# Altium schematic sheet Power_Input.SchDoc: Power input
size A4; SheetNumber: 2; SheetTotal: 4
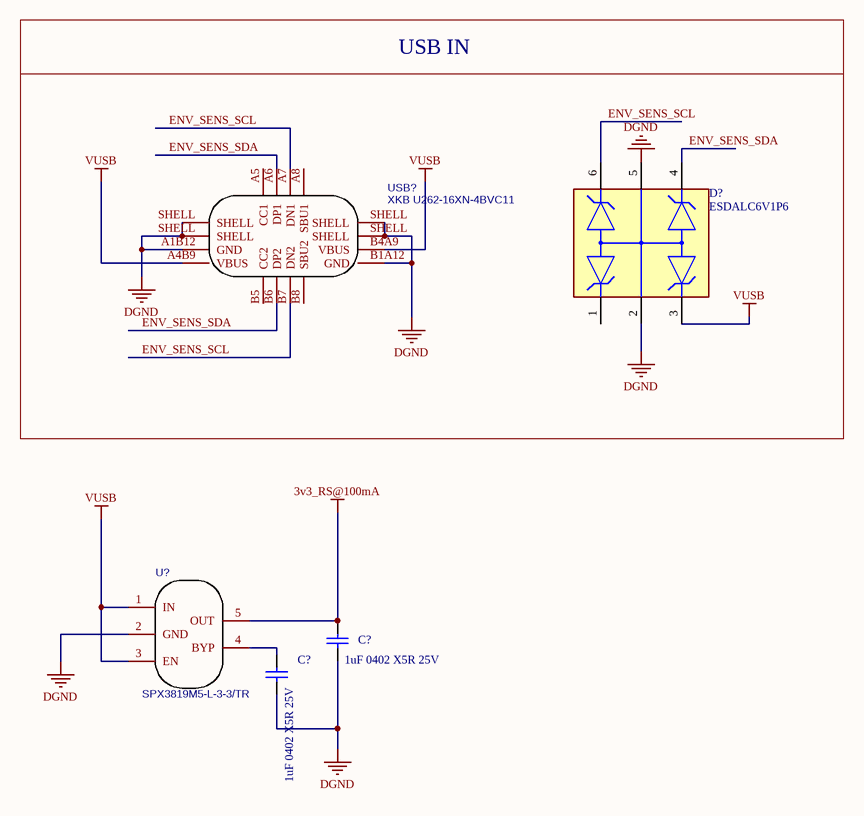
[diagram p0: Power_Input.SchDoc]

## Parts
(Parts that share a designator on the sheet are numbered #1, #2 ... from top to bottom, then left to right.)
C?#1  1uF 0402 X5R 25V  [CAPC1005X55X25NL5T10]
C?#2  1uF 0402 X5R 25V  [CAPC1005X55X25NL5T10]
D?  ESDALC6V1P6  [FP-SOT-666IP-MFG]
U?  SPX3819M5-L-3-3/TR  [SOT-23-5_L3.0-W1.7-P0.95-LS2.8-BR]
USB?  XKB U262-16XN-4BVC11  [U262-161N-4BVC11]

## Blocks framed on the sheet
USB IN: D? USB?

## Nets
3v3_RS@100mA: C?#1.2 U?.5(OUT)
DGND: C?#1.1 C?#2.1 D?.2 D?.5 U?.2(GND) USB?.A1B12(GND) USB?.B1A12(GND) USB?.SHELL
VUSB: D?.3 U?.1(IN) U?.3(EN) USB?.A4B9(VBUS) USB?.B4A9(VBUS)
ENV_SENS_SCL: D?.6 USB?.A7(DN1) USB?.B7(DN2)
ENV_SENS_SDA: D?.4 USB?.A6(DP1) USB?.B6(DP2)
NetC?#2_2: C?#2.2 U?.4(BYP)

Not connected (* = marked no-connect by the designer): D? 1; USB? A5(CC1) A8(SBU1) B5(CC2) B8(SBU2)

## Notes on the sheet
- Title
- Size:
- Date:
- A3
- Author:
- Time:
- Revision:
- Sheet
- of
- File:

## Library data of the parts
C?#1 C?#2 = CMP-1662-00020-1: ComponentLink2Description: Datasheet; ComponentLink2URL: http://psearch.en.murata.com/capacitor/product/GRM155R60J105KE19%23.pdf; ComponentLink1Description: Manufacturer URL; ComponentLink1URL: http://www.murata.com/; LCSC_PN: C77009
D? = CMP-12225-000016-1: TVS DIODE 3V SOT666IP; Manufacturer: STMicroelectronics; Peak Pulse Power: 30W; Capacitance: 7.5pF; Value: 7.5pF; Number Of Channels: 4; Max Junction Temp: +150°C; Breakdown Voltage: 6.1V; Direction: Unidirectional; Device Class L1: Circuit Protection; Reverse Standoff Voltage: 3V; Package: SOT-666IP; Device Class L3: unset; Temperature Range Low: -40°C; ComponentLink2Description: Datasheet; Height: 0.62mm; ComponentLink2URL: https://www.st.com/resource/en/datasheet/esdalc6v1px.pdf; Category: Diode; RoHS: TRUE; Device Class L2: TVS Diodes; Mouser Description: ESDALC Series 4 Channel 6.1V Uni-Directional Transil? ESD Protection - SOT-666IP; Lead Free: Yes; Manufacturer Part Number: ESDALC6V1P6; Temperature Range High: +150°C; Temperature: -40°C to +150°C; Digikey Description: TVS DIODE 3V SOT666IP; Automotive: No; Octopart: https://octopart.com/esdalc6v1p6-stmicroelectronics-347727; LCSC_PN: C1976562
U? = SPX3819M5-L-3-3/TR: BOM_Manufacturer: EXAR; BOM_Supplier: LCSC; BOM_Manufacturer Part: SPX3819M5-L-3-3/TR; BOM_Supplier Part: C9055; BOM_JLCPCB Part Class: Extended Part; spicePre: U; spiceSymbolName: SPX3819M5-L-3-3/TR; LCSC_PN: C9055
USB? = XKB U262-16XN-4BVC11: BOM_Manufacturer: XKB Enterprise; Contributor: LCSC; BOM_Supplier: LCSC; BOM_Supplier Part: C319148; BOM_Manufacturer Part: U262-16XN-4BVC11; BOM_JLCPCB Part Class: Extended Part; LCSC_PN: C319148